# EAGLE design CircuitoEmitter2.0 (EAGLE 7.5.0)
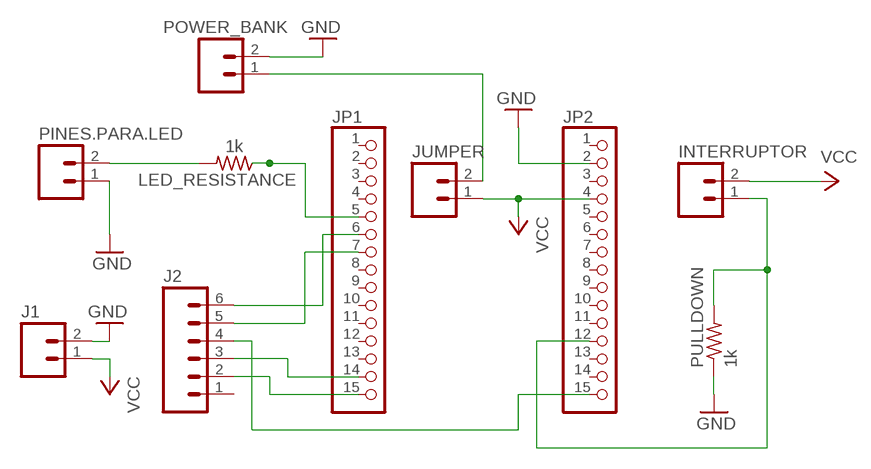
[diagram p0: schematic, sheet 1]

## Parts
INTERRUPTOR  M02LOCK_LONGPADS  [1X02_LOCK_LONGPADS]
J1  M02LOCK_LONGPADS  [1X02_LOCK_LONGPADS]
J2  M06LONGPADS  [1X06_LONGPADS]
JP1  PINHD-1X15  [1X15]
JP2  PINHD-1X15  [1X15]
JUMPER  M02LOCK_LONGPADS  [1X02_LOCK_LONGPADS]
LED_RESISTANCE  1k  R-US_0204/7  [0204/7]
PINES.PARA.LED  M02LOCK_LONGPADS  [1X02_LOCK_LONGPADS]
POWER_BANK  M02LOCK_LONGPADS  [1X02_LOCK_LONGPADS]
PULLDOWN  1k  R-US_0204/7  [0204/7]

## Nets
GND: J1.2 JP2.2 PINES.PARA.LED.1 POWER_BANK.2 PULLDOWN.1
N$1: J2.5 JP1.7
N$3: J2.4 JP2.15
N$4: J2.3 JP1.14
N$5: J2.2 JP1.15
N$6: INTERRUPTOR.1 JP2.12 PULLDOWN.2
N$7: JUMPER.2 POWER_BANK.1
N$8: LED_RESISTANCE.2 PINES.PARA.LED.2
N$9: JP1.5 LED_RESISTANCE.1
N$10: J2.6 JP1.6
VCC: INTERRUPTOR.2 J1.1 JP2.4 JUMPER.1
Unconnected: J2.1 JP1.1 JP1.2 JP1.3 JP1.4 JP1.8 JP1.9 JP1.10 JP1.11 JP1.12 JP1.13 JP2.1 JP2.3 JP2.5 JP2.6 JP2.7 JP2.8 JP2.9 JP2.10 JP2.11 JP2.13 JP2.14

## Library data of the parts
INTERRUPTOR J1 JUMPER PINES.PARA.LED POWER_BANK = mecatronica_eagle_lib:M02: Standard 2-pin 0.1" header. Use with - straight break away headers ( PRT-00116) - right angle break away headers (PRT-00553) - swiss pins (PRT-00743) - machine pins (PRT-00117) - female headers (PRT-00115) Molex polarized connector foot print use with: PRT-08233 with associated crimp pins and housings. 2.54_SCREWTERM for use with PRT-10571. 3.5mm Screw Terminal footprints for PRT-08084 5mm Screw Terminal footprints for use with PRT-08432
J2 = mecatronica_eagle_lib:M06: Header 6 Standard 6-pin 0.1" header. Use with straight break away headers (SKU : PRT-00116), right angle break away headers (PRT-00553), swiss pins (PRT-00743), machine pins (PRT-00117), and female headers (PRT-00115). Molex polarized connector foot print use with SKU : PRT-08094 with associated crimp pins and housings. NOTES ON THE VARIANTS LOCK and LOCK_LONGPADS... This footprint was designed to help hold the alignment of a through-hole component (i.e. 6-pin header) while soldering it into place. You may notice that each hole has been shifted either up or down by 0.005 of an inch from it's more standard position (which is a perfectly straight line). This slight alteration caused the pins (the squares in the middle) to touch the edges of the holes. Because they are alternating, it causes a "brace" to hold the component in place. 0.005 has proven to be the perfect amount of "off-center" position when using our standard breakaway headers. Although looks a little odd when you look at the bare footprint, once you have a header in there, the alteration is very hard to notice. Also,if you push a header all the way into place, it is covered up entirely on the bottom side. This idea of altering the position of holes to aid alignment will be further integrated into the Sparkfun Library for other footprints. It can help hold any component with 3 or more connection pins.
JP1 JP2 = adafruit:PINHD-1X15: PIN HEADER
LED_RESISTANCE PULLDOWN = adafruit:R-US_: RESISTOR, American symbol

## Net classes
0 default: width 0.305 mm, drill 0.508 mm, clearance 0.254 mm

## Board
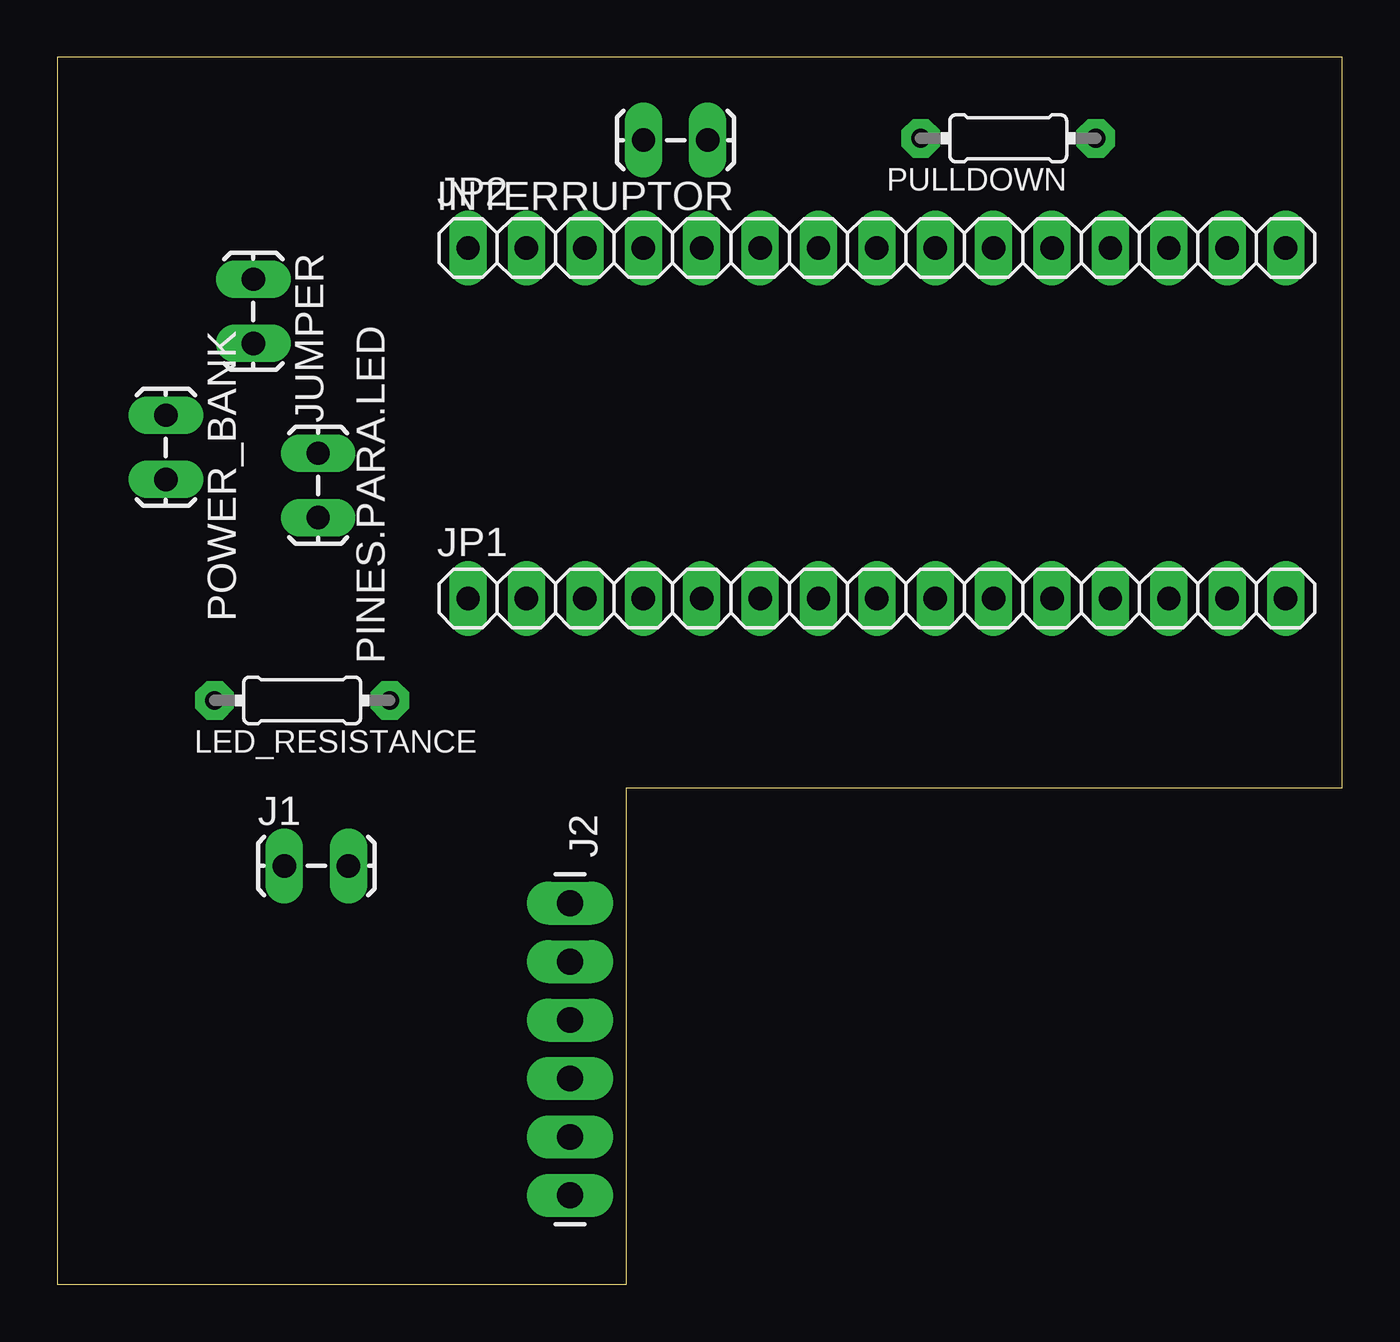
[diagram p1: board, top side]
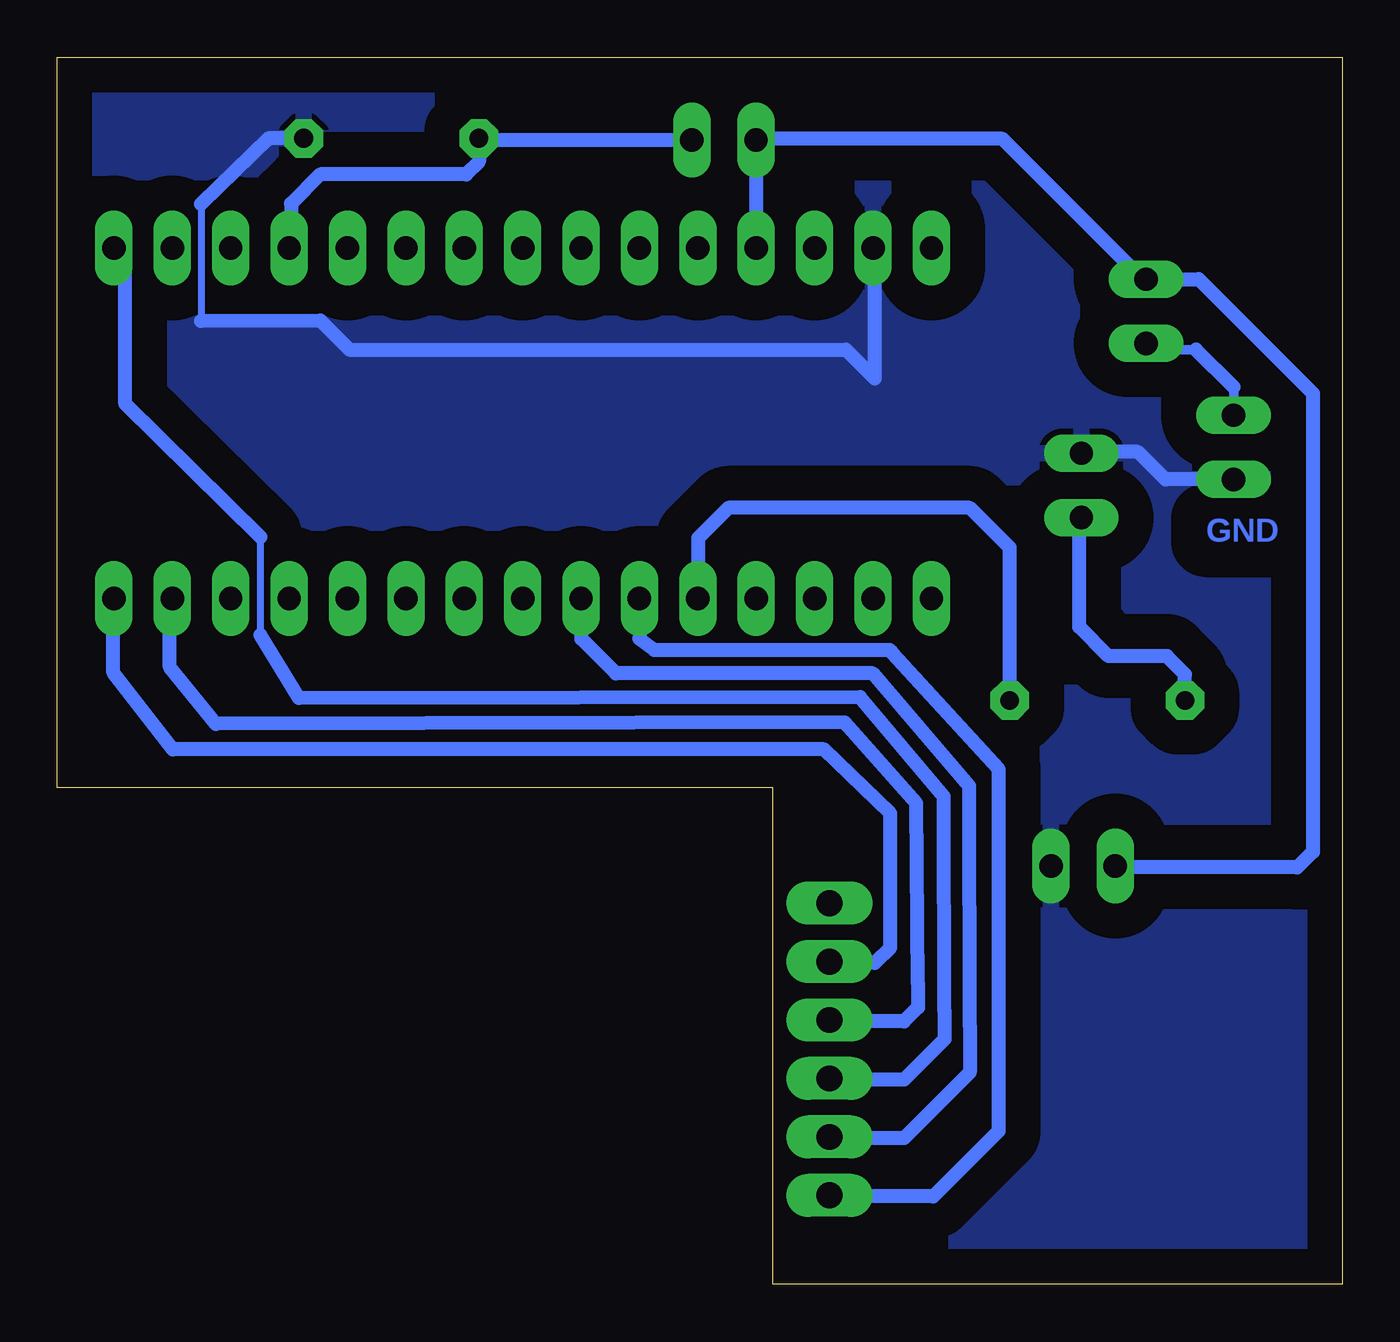
[diagram p2: board, bottom side, seen from below]

Size 55.88 x 53.34 mm. Coordinates in mm from the lower left corner, seen from the top.
Outline: 0,0 24.77,0 24.77,21.59 55.88,21.59 55.88,53.34 0,53.34 0,0
Copper layers (1*16): Top 0.035mm / dielectric 1.5mm / Bottom 0.035mm
Design rules "config_through_hole": minimum track width 8mil, minimum drill 20mil, track to track 9mil, track to pad 9mil, pad to pad 9mil, via to via 9mil, smd to smd 8mil, copper to edge 15mil, drill to drill 8mil, minimum pad ring 12mil, minimum via ring 10mil, stop-mask expansion 4mil, vias tented up to drill 25mil, thermal gap 10mil

### Footprints (pad centres in the part's own frame; a part is rotated, then mirrored left to right if it is on the bottom)
1X02_LOCK_LONGPADS = drill 1.016 long: 1 -0.127,0; 2 2.667,0
1X06_LONGPADS = drill 1.118 pad 1.88 long: 1 0,0; 2 2.54,0; 3 5.08,0; 4 7.62,0; 5 10.16,0; 6 12.7,0
1X15 = drill 1.016 long: 1 -17.78,0; 2 -15.24,0; 3 -12.7,0; 4 -10.16,0; 5 -7.62,0; 6 -5.08,0; 7 -2.54,0; 8 0,0; 9 2.54,0; 10 5.08,0; 11 7.62,0; 12 10.16,0; 13 12.7,0; 14 15.24,0; 15 17.78,0
0204/7 = drill 0.813 pad 1.676 octagon: 1 -3.81,0; 2 3.81,0

### Placement (x,y rotation side)
INTERRUPTOR  28.16,49.75 180 top
J1  9.99,18.18 0 top
J2  22.3,16.56 270 top
JP1  35.64,29.82 0 top
JP2  35.64,45.06 0 top
JUMPER  8.52,43.57 270 top
LED_RESISTANCE  10.64,25.38 180 top
PINES.PARA.LED  11.34,36 270 top
POWER_BANK  4.72,37.66 270 top
PULLDOWN  41.36,49.83 180 top

### Tracks (layer width: path | path; a pad name or v marks a point on that pad's centre or on a via)
GND
  Bottom 0.305: 49.63,46.97 49.63,41.89
  Bottom 0.61: PULLDOWN.1 46.69,49.83 49.63,46.97 | 49.63,41.89 44.45,41.91 43.18,40.64 21.59,40.64 20.32,39.37 20.32,44.98 JP2.2 | POWER_BANK.2 7.69,34.99 8.89,36.2 11.28,36.2 PINES.PARA.LED.1
  pour Bottom (isolate 1.524): -0.48,54.05 56.05,53.66 56.44,21.67 24.06,21.43 23.82,-1.51 -0.32,-0.87
N$1
  Bottom 0.61: JP1.7 33.09,29.81 33.09,28.06 31.59,26.56 20.41,26.56 16.22,21.66 16.19,11.25 16.19,9.21 19.05,6.35 22.25,6.35 J2.5
N$3
  Bottom 0.305: 47.05,28.22 47.05,32.48
  Bottom 0.61: 47.05,28.22 45.37,25.48 20.97,25.52 17.32,21.2 17.29,11.85 17.29,10.65 19.05,8.89 22.25,8.89 J2.4 | 47.05,32.48 52.93,38.28 52.93,44.57 JP2.15
N$4
  Bottom 0.61: JP1.14 50.99,29.71 50.99,26.83 48.99,24.36 21.64,24.42 18.52,20.9 18.45,13.04 18.45,12.03 19.05,11.43 22.25,11.43 J2.3
N$5
  Bottom 0.61: JP1.15 53.45,29.79 53.45,26.59 50.87,23.25 22.53,23.25 19.65,20.47 19.65,14.64 20.32,13.97 22.25,13.97 J2.2
N$6
  Bottom 0.61: INTERRUPTOR.1 37.48,49.75 PULLDOWN.2 37.55,48.81 38.1,48.26 44.45,48.26 45.72,46.99 45.72,45.14 JP2.12
N$7
  Bottom 0.406: POWER_BANK.1 4.72,39.01 | 6.35,40.64 8.26,40.64 JUMPER.2
  Bottom 0.61: 4.72,39.01 6.35,40.64
N$8
  Bottom 0.61: LED_RESISTANCE.2 6.83,26.52 7.62,27.3 10.16,27.3 11.43,28.57 11.43,33.25 PINES.PARA.LED.2
N$9
  Bottom 0.61: LED_RESISTANCE.1 14.45,32.02 16.19,33.76 26.69,33.76 28.01,32.44 28.01,29.83 JP1.5
N$10
  Bottom 0.61: JP1.6 30.56,28.07 29.91,27.58 19.67,27.58 19.59,27.46 14.93,22.38 14.93,6.66 17.78,3.81 22.25,3.81 J2.6
VCC
  Bottom 0.61: JP2.4 25.49,45.07 INTERRUPTOR.2 25.44,49.8 14.77,49.8 8.67,43.7 JUMPER.1 6.23,43.7 1.27,38.73 1.27,18.8 1.95,18.12 9.8,18.12 J1.1

### Text on the board
Bottom: GND